# Altium schematic sheet MotorTreiber.SchDoc
size A4
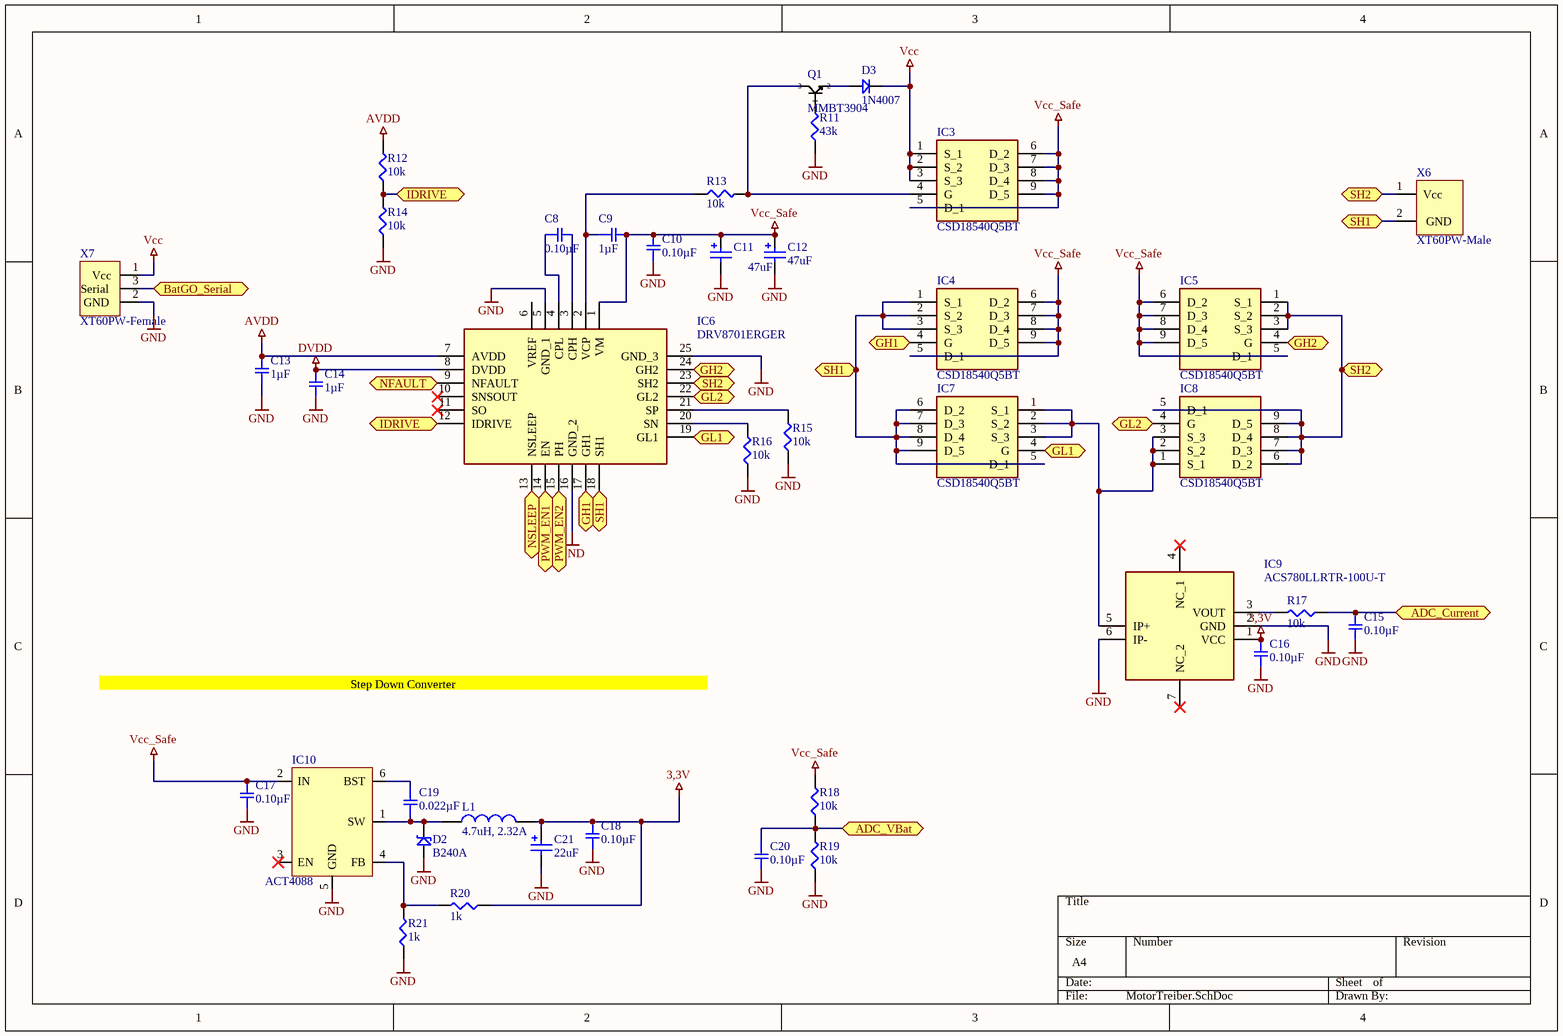
[diagram p0: MotorTreiber.SchDoc]

## Parts
C8  0.10µF  [SMD-0402C]
C9  1µF  [SMD-0402C]
C10  0.10µF  [SMD-0402C]
C11  value 47uF  [WCAP-ASLI_6.3x7.7]  (hidden comment: 865080645012)
C12  value 47uF  [WCAP-ASLI_6.3x7.7]  (hidden comment: 865080645012)
C13  1µF  [SMD-0402C]
C14  1µF  [SMD-0402C]
C15  0.10µF  [SMD-0402C]
C16  0.10µF  [SMD-0402C]
C17  0.10µF  [SMD-0402C]
C18  0.10µF  [SMD-0402C]
C19  0.022µF  [SMD-0603C]
C20  0.10µF  [SMD-0402C]
C21  value 22uF  [WCAP-ASLI_4x5.5]  (hidden comment: 865080140001)
D2  B240A  [B240A]
D3  1N4007  [SOD-323]
IC3  CSD18540Q5BT  [CSD18540Q5BT]
IC4  CSD18540Q5BT  [CSD18540Q5BT]
IC5  CSD18540Q5BT  [CSD18540Q5BT]
IC6  DRV8701ERGER  [QFN50P400X400X100-25N-D]
IC7  CSD18540Q5BT  [CSD18540Q5BT]
IC8  CSD18540Q5BT  [CSD18540Q5BT]
IC9  ACS780LLRTR-100U-T  [7-PIN_PSOF]
IC10  ACT4088  [SOT23-6]
L1  4.7uH, 2.32A  [WE-PD_7332]
Q1  MMBT3904  [SOT23]
R11  43k  [SMD-0402-RES]
R12  10k  [SMD-0402-RES]
R13  10k  [SMD-0402-RES]
R14  10k  [SMD-0402-RES]
R15  10k  [SMD-0402-RES]
R16  10k  [SMD-0402-RES]
R17  10k  [SMD-0402-RES]
R18  10k  [SMD-0402-RES]
R19  10k  [SMD-0402-RES]
R20  1k  [SMD-0603-RES]
R21  1k  [SMD-0603-RES]
X6  XT60PW-Male  [XT60PW_Male]
X7  XT60PW-Female  [XT60PWI-M_Female]

## Ports
ADC_Current (bidir), ADC_VBat (bidir), BatGO_Serial (bidir), GH1 (bidir), GH2 (bidir), GL1 (bidir), GL2 (bidir), IDRIVE (bidir), NFAULT (bidir), NSLEEP (bidir), PWM_EN1 (bidir), PWM_EN2 (bidir), SH1 (bidir), SH2 (bidir)

## Nets
3,3V: C16.1 C18.1 C21.1(P) IC9.1(VCC) L1.2 R20.1
AVDD: C13.1 IC6.7(AVDD) R12.2
DVDD: C14.1 IC6.8(DVDD)
GND: C10.1 C11.2(N) C12.2(N) C13.2 C14.2 C15.2 C16.2 C17.2 C18.2 C20.2 C21.2(N) D2.A IC6.5(GND_1) IC6.16(GND_2) IC6.25(GND_3) IC9.2(GND) IC9.6(IP-) IC10.5(GND) R11.1 R14.1 R15.1 R16.1 R19.1 R21.1 X7.2(GND)
Vcc: D3.K IC3.1(S_1) IC3.2(S_2) IC3.3(S_3) X7.1(Vcc)
Vcc_Safe: C9.2 C10.2 C11.1(P) C12.1(P) C17.1 IC3.5(D_1) IC3.6(D_2) IC3.7(D_3) IC3.8(D_4) IC3.9(D_5) IC4.5(D_1) IC4.6(D_2) IC4.7(D_3) IC4.8(D_4) IC4.9(D_5) IC5.5(D_1) IC5.6(D_2) IC5.7(D_3) IC5.8(D_4) IC5.9(D_5) IC6.1(VM) IC10.2(IN) R18.2
ADC_Current: C15.1 R17.1 ; port ADC_Current
ADC_VBat: C20.1 R18.1 R19.2 ; port ADC_VBat
BatGO_Serial: X7.3(Serial) ; port BatGO_Serial
GH1: IC4.4(G) IC6.17(GH1) ; port GH1
GH2: IC5.4(G) IC6.24(GH2) ; port GH2
GL1: IC6.19(GL1) IC7.4(G) ; port GL1
GL2: IC6.22(GL2) IC8.4(G) ; port GL2
IDRIVE: IC6.12(IDRIVE) R12.1 R14.2 ; port IDRIVE
NFAULT: IC6.9(NFAULT) ; port NFAULT
NSLEEP: IC6.13(NSLEEP) ; port NSLEEP
PWM_EN1: IC6.14(EN) ; port PWM_EN1
PWM_EN2: IC6.15(PH) ; port PWM_EN2
SH1: IC4.1(S_1) IC4.2(S_2) IC4.3(S_3) IC6.18(SH1) IC7.5(D_1) IC7.6(D_2) IC7.7(D_3) IC7.8(D_4) IC7.9(D_5) X6.2(GND) ; port SH1
SH2: IC5.1(S_1) IC5.2(S_2) IC5.3(S_3) IC6.23(SH2) IC8.5(D_1) IC8.6(D_2) IC8.7(D_3) IC8.8(D_4) IC8.9(D_5) X6.1(Vcc) ; port SH2
NetC8_1: C8.1 IC6.4(CPL)
NetC8_2: C8.2 IC6.3(CPH)
NetC9_1: C9.1 IC6.2(VCP) R13.1
NetC19_1: C19.1 IC10.6(BST)
NetC19_2: C19.2 D2.K IC10.1(SW) L1.1
NetD3_A: D3.A Q1.S(2)
NetIC3_4: IC3.4(G) Q1.D(3) R13.2
NetIC6_20: IC6.20(SN) R16.2
NetIC6_21: IC6.21(SP) R15.2
NetIC7_1: IC7.1(S_1) IC7.2(S_2) IC7.3(S_3) IC8.1(S_1) IC8.2(S_2) IC8.3(S_3) IC9.5(IP+)
NetIC9_3: IC9.3(VOUT) R17.2
NetIC10_4: IC10.4(FB) R20.2 R21.2
NetQ1_G: Q1.G(1) R11.2

Not connected (* = marked no-connect by the designer): IC6 6(VREF) 10(SNSOUT)* 11(SO)*; IC9 4(NC_1)* 7(NC_2)*; IC10 3(EN)*

## Notes on the sheet
- Step Down Converter

## Library data of the parts
C8 C10 C15-C18 C20 = GCM155R71C104KA55D: CAP CER 0.1UF 16V X7R 0402; Manufacturer: Murata Electronics North America; Factory Stock: 0; Unit Price (USD): 0.1; Minimum Quantity: 1; Tolerance: ±10%; Datasheets: http://www.murata.com/~/media/webrenewal/support/library/catalog/products/capacitor/mlcc/c03e.ashx; Image: //media.digikey.com/Renders/Murata%20Renders/ZRB-SERIES-0402.jpg; Digi-Key Part Number: 490-4759-1-ND; Part Number: GCM155R71C104KA55D; Quantity Available: 734194; @ qty: 0; Packaging: Cut Tape (CT); Series: GCM; Part Status: Active; Value: 0.10µF; Voltage: 16V; Temperature Coefficient: X7R; Operating Temperature: -55°C ~ 125°C; Features: -; Ratings: AEC-Q200; Applications: Automotive; Mounting Type: Surface Mount, MLCC; Package / Case: 0402 (1005 Metric); Size / Dimension: 0.039" L x 0.020" W (1.00mm x 0.50mm); Height - Seated (Max): -; Thickness (Max): 0.022" (0.55mm); Lead Spacing: -; Lead Style: -
C9 C13 C14 = GRM155C80J105KE02D: CAP CER 1UF 6.3V X6S 0402; Manufacturer: Murata Electronics North America; Factory Stock: 0; Unit Price (USD): 0.1; Minimum Quantity: 1; Tolerance: ±10%; Datasheets: http://www.murata.com/~/media/webrenewal/support/library/catalog/products/capacitor/mlcc/c02e.pdf; Image: //media.digikey.com/Renders/Murata%20Renders/ZRB-SERIES-0402.jpg; Digi-Key Part Number: 490-10433-1-ND; Part Number: GRM155C80J105KE02D; Quantity Available: 34510; @ qty: 0; Packaging: Cut Tape (CT); Series: GRM; Part Status: Active; Value: 1µF; Voltage: 6.3V; Temperature Coefficient: X6S; Operating Temperature: -55°C ~ 105°C; Features: Derating Recommended; Ratings: -; Applications: General Purpose; Mounting Type: Surface Mount, MLCC; Package / Case: 0402 (1005 Metric); Size / Dimension: 0.039" L x 0.020" W (1.00mm x 0.50mm); Height - Seated (Max): -; Thickness (Max): 0.022" (0.55mm); Lead Spacing: -; Lead Style: -
C11 C12 = 865080645012: WCAP-ASLI Aluminum Electrolytic Capacitors, size Ф6.3x7.7mm, 50V DC, 47uF; Rated Voltage: 50V DC; ComponentLink1Description: Manufacturer; ComponentLink1URL: http://www.we-online.de; ComponentLink2Description: Datasheet; ComponentLink2URL: http://katalog.we-online.de/pbs/datasheet/865080645012.pdf; Part Number: 865080645012; Published Date: June 2017; Publisher: Wurth Elektronik; Size: Ф6.3x7.7mm; Life Cycle: 2000h; Operating Temperature: -55 °C up to +105 °C
C19 = GCJ188R71H223KA01D: CAP CER 0.022UF 50V X7R 0603; Manufacturer: Murata Electronics North America; Factory Stock: 0; Unit Price (USD): 0.22; Minimum Quantity: 1; Tolerance: ±10%; Datasheets: http://www.murata.com/~/media/webrenewal/support/library/catalog/products/capacitor/mlcc/c03e.ashx; Image: //media.digikey.com/Renders/Murata%20Renders/0603%28LQG18%29.jpg; Digi-Key Part Number: 490-5851-1-ND; Part Number: GCJ188R71H223KA01D; Quantity Available: 7651; @ qty: 0; Packaging: Cut Tape (CT); Series: GCJ; Part Status: Active; Value: 0.022µF; Voltage: 50V; Temperature Coefficient: X7R; Operating Temperature: -55°C ~ 125°C; Features: Soft Termination; Ratings: AEC-Q200; Applications: Automotive, Boardflex Sensitive; Mounting Type: Surface Mount, MLCC; Package / Case: 0603 (1608 Metric); Size / Dimension: 0.063" L x 0.031" W (1.60mm x 0.80mm); Height - Seated (Max): -; Thickness (Max): 0.031" (0.80mm); Lead Spacing: -; Lead Style: -
C21 = 865080140001: WCAP-ASLI Aluminum Electrolytic Capacitors, size Ф4x5.5mm, 6.3V DC, 22uF; Rated Voltage: 6.3V DC; ComponentLink1Description: Manufacturer; ComponentLink1URL: http://www.we-online.de; ComponentLink2Description: Datasheet; ComponentLink2URL: http://katalog.we-online.de/pbs/datasheet/865080140001.pdf; Part Number: 865080140001; Published Date: June 2017; Publisher: Wurth Elektronik; Size: Ф4x5.5mm; Life Cycle: 2000h; Operating Temperature: -55 °C up to +105 °C
D2 = B240A: Shottkydiode
IC3-IC5 IC7 IC8 = CSD18540Q5BT: Integrated Circuit; Manufacturer_Name: Texas Instruments; Datasheet Link: http://www.ti.com/lit/gpn/CSD18540Q5B; Height: 1.05mm; Manufacturer_Part_Number: CSD18540Q5BT; Arrow Part Number: CSD18540Q5BT; Arrow Price/Stock: https://www.arrow.com/en/products/csd18540q5bt/texas-instruments; Mouser Part Number: 595-CSD18540Q5BT; Mouser Price/Stock: https://www.mouser.co.uk/ProductDetail/Texas-Instruments/CSD18540Q5BT?qs=NRIcxvoDUteGYlfdfF0DmQ%3D%3D
IC6 = DRV8701ERGER: Integrated Circuit; Manufacturer_Name: Texas Instruments; Datasheet Link: http://www.ti.com/lit/gpn/DRV8701; Height: 1mm; Manufacturer_Part_Number: DRV8701ERGER; Arrow Part Number: DRV8701ERGER; Arrow Price/Stock: https://www.arrow.com/en/products/drv8701erger/texas-instruments; Mouser Part Number: 595-DRV8701ERGER; Mouser Price/Stock: https://www.mouser.co.uk/ProductDetail/Texas-Instruments/DRV8701ERGER?qs=UfUFg%2FkmHHGO0gqJCiEBBQ%3D%3D
IC9 = ACS780LLRTR-100U-T: Integrated Circuit; Manufacturer_Name: Allegro Microsystems; Datasheet Link: https://www.allegromicro.com/~/media/Files/Datasheets/ACS780-Datasheet.ashx; Manufacturer_Part_Number: ACS780LLRTR-100U-T; Arrow Part Number: ACS780LLRTR-100U-T; Arrow Price/Stock: https://www.arrow.com/en/products/acs780llrtr-100u-t/allegro-microsystems
L1 = 744778004: WE-PD SMT Power Inductor, size 7332, 4.7uH, 2.32A; DC Resistance max.: 60mOhm; Self Resonant Frequency: 45MHz; Saturation Current: 4.2A; ComponentLink1Description: Manufacturer; ComponentLink1URL: http://www.we-online.de; ComponentLink2Description: Datasheet; ComponentLink2URL: https://katalog.we-online.com/pbs/datasheet/744778004.pdf; Part Number: 744778004; Published Date: April 2019; Publisher: Wurth Elektronik; Rated Current: 2.32A; Size: 7332; Inductance: 4.7uH; Operating Temperature: -40 to +125degC; Mounting Technology: SMT; Packaging: Tape and Reel
R11 = ERJ-2GEJ433X: RES SMD 43K OHM 5% 1/10W 0402; Manufacturer: Panasonic Electronic Components; Factory Stock: 0; Unit Price (USD): 0.00350; @ qty: 1500; Minimum Quantity: 1; Power (Watts): 0.1W, 1/10W; Temperature Coefficient: ±200ppm/°C; Part Number: ERJ-2GEJ433X; Datasheets: http://industrial.panasonic.com/www-cgi/jvcr13pz.cgi?E+PZ+3+AOA0001+ERJ2GEJ433X+7+WW; Image: //media.digikey.com/Photos/Panasonic%20Photos/ERJ-PA2-Series.jpg; Digi-Key Part Number: P43KJCT-ND; Quantity Available: 117636; Packaging: Cut Tape (CT); Series: ERJ; Part Status: Active; Value: 43k; Tolerance: ±5%; Composition: Thick Film; Features: Automotive AEC-Q200; Operating Temperature: -55°C ~ 155°C; Package / Case: 0402 (1005 Metric); Supplier Device Package: 0402; Size / Dimension: 0.039" L x 0.020" W (1.00mm x 0.50mm); Height - Seated (Max): 0.016" (0.40mm); Number of Terminations: 2; Failure Rate: -
R12-R19 = ERJ-2GEJ103X: RES SMD 10K OHM 5% 1/10W 0402; Manufacturer: Panasonic Electronic Components; Factory Stock: 0; Unit Price (USD): 0.00350; @ qty: 1500; Minimum Quantity: 1; Power (Watts): 0.1W, 1/10W; Temperature Coefficient: ±200ppm/°C; Part Number: ERJ-2GEJ103X; Datasheets: http://industrial.panasonic.com/www-cgi/jvcr13pz.cgi?E+PZ+3+AOA0001+ERJ2GEJ103X+7+WW; Image: //media.digikey.com/Photos/Panasonic%20Photos/ERJ-PA2-Series.jpg; Digi-Key Part Number: P10KJCT-ND; Quantity Available: 2560215; Packaging: Cut Tape (CT); Series: ERJ; Part Status: Active; Value: 10k; Tolerance: ±5%; Composition: Thick Film; Features: Automotive AEC-Q200; Operating Temperature: -55°C ~ 155°C; Package / Case: 0402 (1005 Metric); Supplier Device Package: 0402; Size / Dimension: 0.039" L x 0.020" W (1.00mm x 0.50mm); Height - Seated (Max): 0.016" (0.40mm); Number of Terminations: 2; Failure Rate: -
R20 R21 = ERJ-3EKF1001V: RES SMD 1K OHM 1% 1/10W 0603; Manufacturer: Panasonic Electronic Components; Factory Stock: 0; Unit Price (USD): 0.00379; @ qty: 1500; Minimum Quantity: 1; Power (Watts): 0.1W, 1/10W; Temperature Coefficient: ±100ppm/°C; Part Number: ERJ-3EKF1001V; Datasheets: http://industrial.panasonic.com/www-cgi/jvcr13pz.cgi?E+PZ+3+AOA0002+ERJ3EKF1001V+7+WW; Image: //media.digikey.com/Photos/Panasonic%20Photos/MFG_ERJ-P6W%20Series.jpg; Digi-Key Part Number: P1.00KHCT-ND; Quantity Available: 5218845; Packaging: Cut Tape (CT); Series: ERJ; Part Status: Active; Value: 1k; Tolerance: ±1%; Composition: Thick Film; Features: Automotive AEC-Q200; Operating Temperature: -55°C ~ 155°C; Package / Case: 0603 (1608 Metric); Supplier Device Package: 0603; Size / Dimension: 0.063" L x 0.031" W (1.60mm x 0.80mm); Height - Seated (Max): 0.022" (0.55mm); Number of Terminations: 2; Failure Rate: -